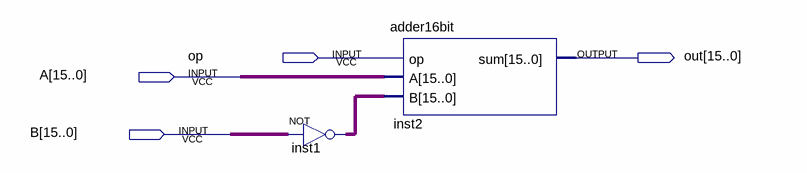
[diagram p0: schematic sheet]
// Quartus schematic subeer16bit.bdf as structural Verilog: 2 symbols, 4 pins
module subeer16bit (
  input  op,
  input  [15:0] A,
  input  [15:0] B,
  output [15:0] out
);

  wire [15:0] inst1_out;

  assign inst1_out = ~B;  // NOT inst1, 16 bits wide
  adder16bit inst2 (.op(op), .A(A), .B(inst1_out), .sum(out));
endmodule
